# Altium project OfflineFlyback_V1.PrjPcb
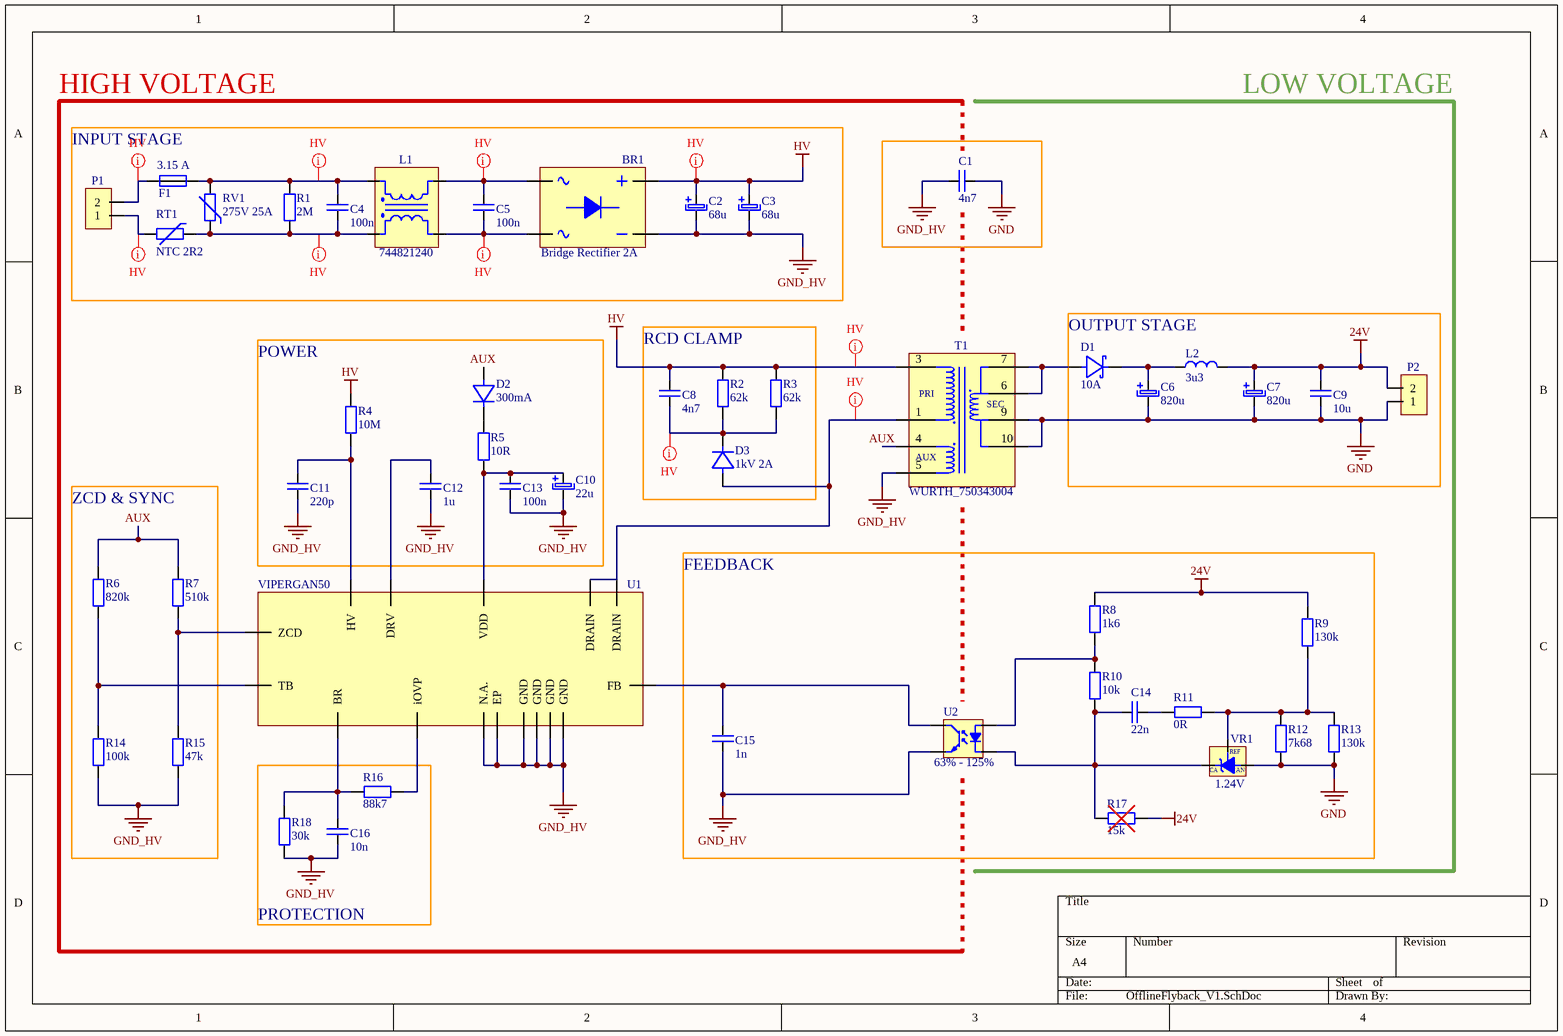
[diagram p0: OfflineFlyback_V1.SchDoc]
1 sheet, 49 parts. Net scope: global (net labels, ports and power ports of the same name join across sheets).
Board files: OfflineFlyback_V1_revA.PcbDoc, OfflineFlyback_V1_revB.PcbDoc

## Sheet OfflineFlyback_V1.SchDoc
size A4; SheetNumber: 1; SheetTotal: 1

### Parts
BR1  Bridge Rectifier 2A  [full_bridge_rectifier_SMD]
C1  4n7  [capacitor_tht_10mm_lead_2_slim]
C2  68u  [capacitor_tht_7mm5_lead_18mm]
C3  68u  [capacitor_tht_7mm5_lead_18mm]
C4  100n  [capacitor_tht_10mm_lead]
C5  100n  [capacitor_tht_10mm_lead]
C6  820u  [capacitor_tht_5mm_lead_10mm]
C7  820u  [capacitor_tht_5mm_lead_10mm]
C8  4n7  [capacitor_smd_1206]
C9  10u  [capacitor_smd_1206]
C10  22u  [capacitor_tht_2mm5_lead_6mm3]
C11  220p  [capacitor_smd_0603]
C12  1u  [capacitor_smd_0603]
C13  100n  [capacitor_smd_0603]
C14  22n  [capacitor_smd_0603]
C15  1n  [capacitor_smd_0603]
C16  10n  [capacitor_smd_0603]
D1  10A  [diode_TO_2787C]
D2  300mA  [diode_smd_sod_123]
D3  1kV 2A  [diode_smd_smb]
F1  3.15 A  [fuse_tht_5mm08]
L1  744821240  [wurth_common_mode_choke_4mm5_10mm]
L2  3u3  [inductor_smd_6mm6_x_7mm3]
P1  Terminal Block  [terminal_block_1X2_5mm08]  (value not drawn)
P2  Terminal Block  [terminal_block_1X2_5mm08]  (value not drawn)
R1  2M  [resisitor_smd_1206]
R2  62k  [resisitor_smd_1206]
R3  62k  [resisitor_smd_1206]
R4  10M  [resisitor_smd_1210]
R5  10R  [resisitor_smd_0603]
R6  820k  [resisitor_smd_0603]
R7  510k  [resisitor_smd_0603]
R8  1k6  [resisitor_smd_0603]
R9  130k  [resisitor_smd_0603]
R10  10k  [resisitor_smd_0603]
R11  0R  [resisitor_smd_0603]
R12  7k68  [resisitor_smd_0603]
R13  130k  [resisitor_smd_0603]
R14  100k  [resisitor_smd_0603]
R15  47k  [resisitor_smd_0603]
R16  88k7  [resisitor_smd_0603]
R17  15k  [resisitor_smd_0603]
R18  30k  [resisitor_smd_0603]
RT1  NTC 2R2  [thermistor_tht_7mm5]
RV1  275V 25A  [varistor_tht_7mm5]
T1  WURTH_750343004  [WURTH_10_PIN_750343004]
U1  VIPERGAN50  [VIPERGAN50TR_V2]
U2  63% - 125%  [SMD-4]
VR1  1.24V  [generic_sot23-3L]

### Blocks framed on the sheet
INPUT STAGE: BR1 C2-C5 F1 L1 P1 R1 RT1 RV1
POWER: C10-C13 D2 R4 R5
RCD CLAMP: C8 D3 R2 R3
OUTPUT STAGE: C6 C7 C9 D1 L2 P2
ZCD & SYNC: R6 R7 R14 R15
FEEDBACK: C14 C15 R8-R13 R17 U2 VR1
PROTECTION: C16 R16 R18

### Nets
24V: C7.1 C9.1 L2.2 P2.2 R8.1 R9.1 R17.2
GND: C1.2 C6.2 C7.2 C9.2 P2.1 R12.2 R13.2 T1.9 T1.10 VR1.3
GND_HV: BR1.4 C1.1 C2.2 C3.2 C10.2 C11.2 C12.2 C13.2 C15.2 C16.2 R14.2 R15.2 R18.2 T1.5 U1.1(GND) U1.2(GND) U1.3(GND) U1.4(GND) U1.7(N.A.) U1.EP U2.3
HV: BR1.3 C2.1 C3.1 C8.1 R2.1 R3.1 R4.1 T1.3
AUX: D2.1 R6.1 R7.1 T1.4
NetBR1_1: BR1.1 C5.2 L1.3
NetBR1_2: BR1.2 C5.1 L1.4
NetC4_1: C4.1 F1.2 L1.1 R1.1 RV1.1
NetC4_2: C4.2 L1.2 R1.2 RT1.2 RV1.2
NetC6_1: C6.1 D1.2 L2.1
NetC8_2: C8.2 D3.2 R2.2 R3.2
NetC10_1: C10.1 C13.1 R5.2 U1.12(VDD)
NetC11_1: C11.1 R4.2 U1.8(HV)
NetC12_1: C12.1 U1.13(DRV)
NetC14_1: C14.1 R10.2 R17.1 U2.2 VR1.2
NetC14_2: C14.2 R11.1
NetC15_1: C15.1 U1.10(FB) U2.4
NetC16_1: C16.1 R16.1 R18.1 U1.5(BR)
NetD1_1: D1.1 T1.6 T1.7
NetD2_2: D2.2 R5.1
NetD3_1: D3.1 T1.1 U1.15(DRAIN) U1.16(DRAIN)
NetF1_1: F1.1 P1.2
NetP1_1: P1.1 RT1.1
NetR6_2: R6.2 R14.1 U1.9(TB)
NetR7_2: R7.2 R15.1 U1.11(ZCD)
NetR8_2: R8.2 R10.1 U2.1
NetR9_2: R9.2 R11.2 R12.1 R13.1 VR1.1
NetR16_2: R16.2 U1.6(iOVP)

### Layout directives
net class HV; rule Clearance Constraint [Clearance = 1mm]: HV, NetBR1_1, NetBR1_2, NetC4_1, NetC4_2, NetC8_2, NetD3_1, NetF1_1, NetP1_1

### Notes on the sheet
- HIGH VOLTAGE
- LOW VOLTAGE
- (in symbol Programmable Shunt Voltage Reference) REF; CA; AN
- (in symbol Wurth - 10 pins - 750343004) PRI; SEC; AUX

### Library data of the parts
BR1 = Bridge Rectifier: Bourns CD-MBL210SL
C1 = Capacitor - non-polarised: TDK CD12ZU2GA472MYNKA Y1
C2 C3 = Capacitor - polarised: Panasonic EEU-EE2G680
C4 C5 = Capacitor - non-polarised: Vishay / BC Components BFC233920104 X2
C6 C7 = Capacitor - polarised: Panasonic EEU-FR1V821L
C8 = Capacitor - non-polarised: Kyocera AVX 1206AC472KAT2A X7R
C9 = Capacitor - non-polarised: Samsung CL31B106KBHNNNE X7R
C10 = Capacitor - polarised: Wurth 860240673003
C11 = Capacitor - non-polarised: Samsung CL10B221KC8WPNC X7R
C12 = Capacitor - non-polarised: Samsung CL10B105KB9VPJC X7R
C13 = Capacitor - non-polarised: Vishay / Vitramon GA0603Y104KXAAC31G X7R
C14 = Capacitor - non-polarised: Kyocera AVX 06035C223K4T2A X7R
C15 = Capacitor - non-polarised: Murata GRM1885C1H102JA01D C0G
C16 = Capacitor - non-polarised: Murata GCM188R71H103KA37J X7R
D1 = Diode - Schottkey: Panjit MBR10H150PC-AU_R2_007A1
D2 = Diode - silicon: Vishay 1N4148W-HG3_A-08
D3 = Diode - silicon: MCC FR2M-LTP
F1 = Fuse: Littelfuse 40013150440 3.15 A Slow Blow
L1 = Common Mode Choke: Wurth 744821240 1.5A 4mH
L2 = Inductor: Bourns SRP7028A-3R3M
P1 P2 = Terminal Block 1X2: Adam Tech EBAFA-02-D
R1 = Resistor: Vishay / Draloric RCV12062M00JNEA
R2 R3 = Resistor: Panasonic ERJ-UP8F6202V
R4 = Resistor: ROHM KTR25JZPF1005
R5 = Resistor: Vishay CRCW060310R0FKED
R6 = Resistor: Walsin MR06X8203FTL
R7 = Resistor: Bourns CR0603-FX-5103ELF
R8 = Resistor: Bourns CR0603-FX-1601ELF
R9 R13 = Resistor: Panasonic ERJ-3RED1303V 0.5%
R10 = Resistor: Vishay / Dale CRCW060310K0FKEI
R11 = Resistor: Royalohm CQ03WAF0000T5E
R12 = Resistor: Panasonic ERA-3AEB7681V 0.1%
R14 = Resistor: Yageo AC0603FR-7W100KL
R15 = Resistor: Bourns CR0603-FX-4702ELF
R16 = Resistor: Walsin WR06X8872FTL
R17 = Resistor: DO NOT PLACE
R18 = Resistor: Wurth 560112116107
RT1 = Thermistor: Epcos / TDK B57237S0229M000
RV1 = Varistor: Epcos / TDK B72210S0271K101
T1 = Wurth - 10 pins - 750343004
U1 = VIPERGAN50 V3
U2 = Optocoupler: Vishay VO615C-2X019T
VR1 = Programmable Shunt Voltage Reference: STM TS3431AILT